# Altium project Thesis_HarvestEvaluator.PrjPcb
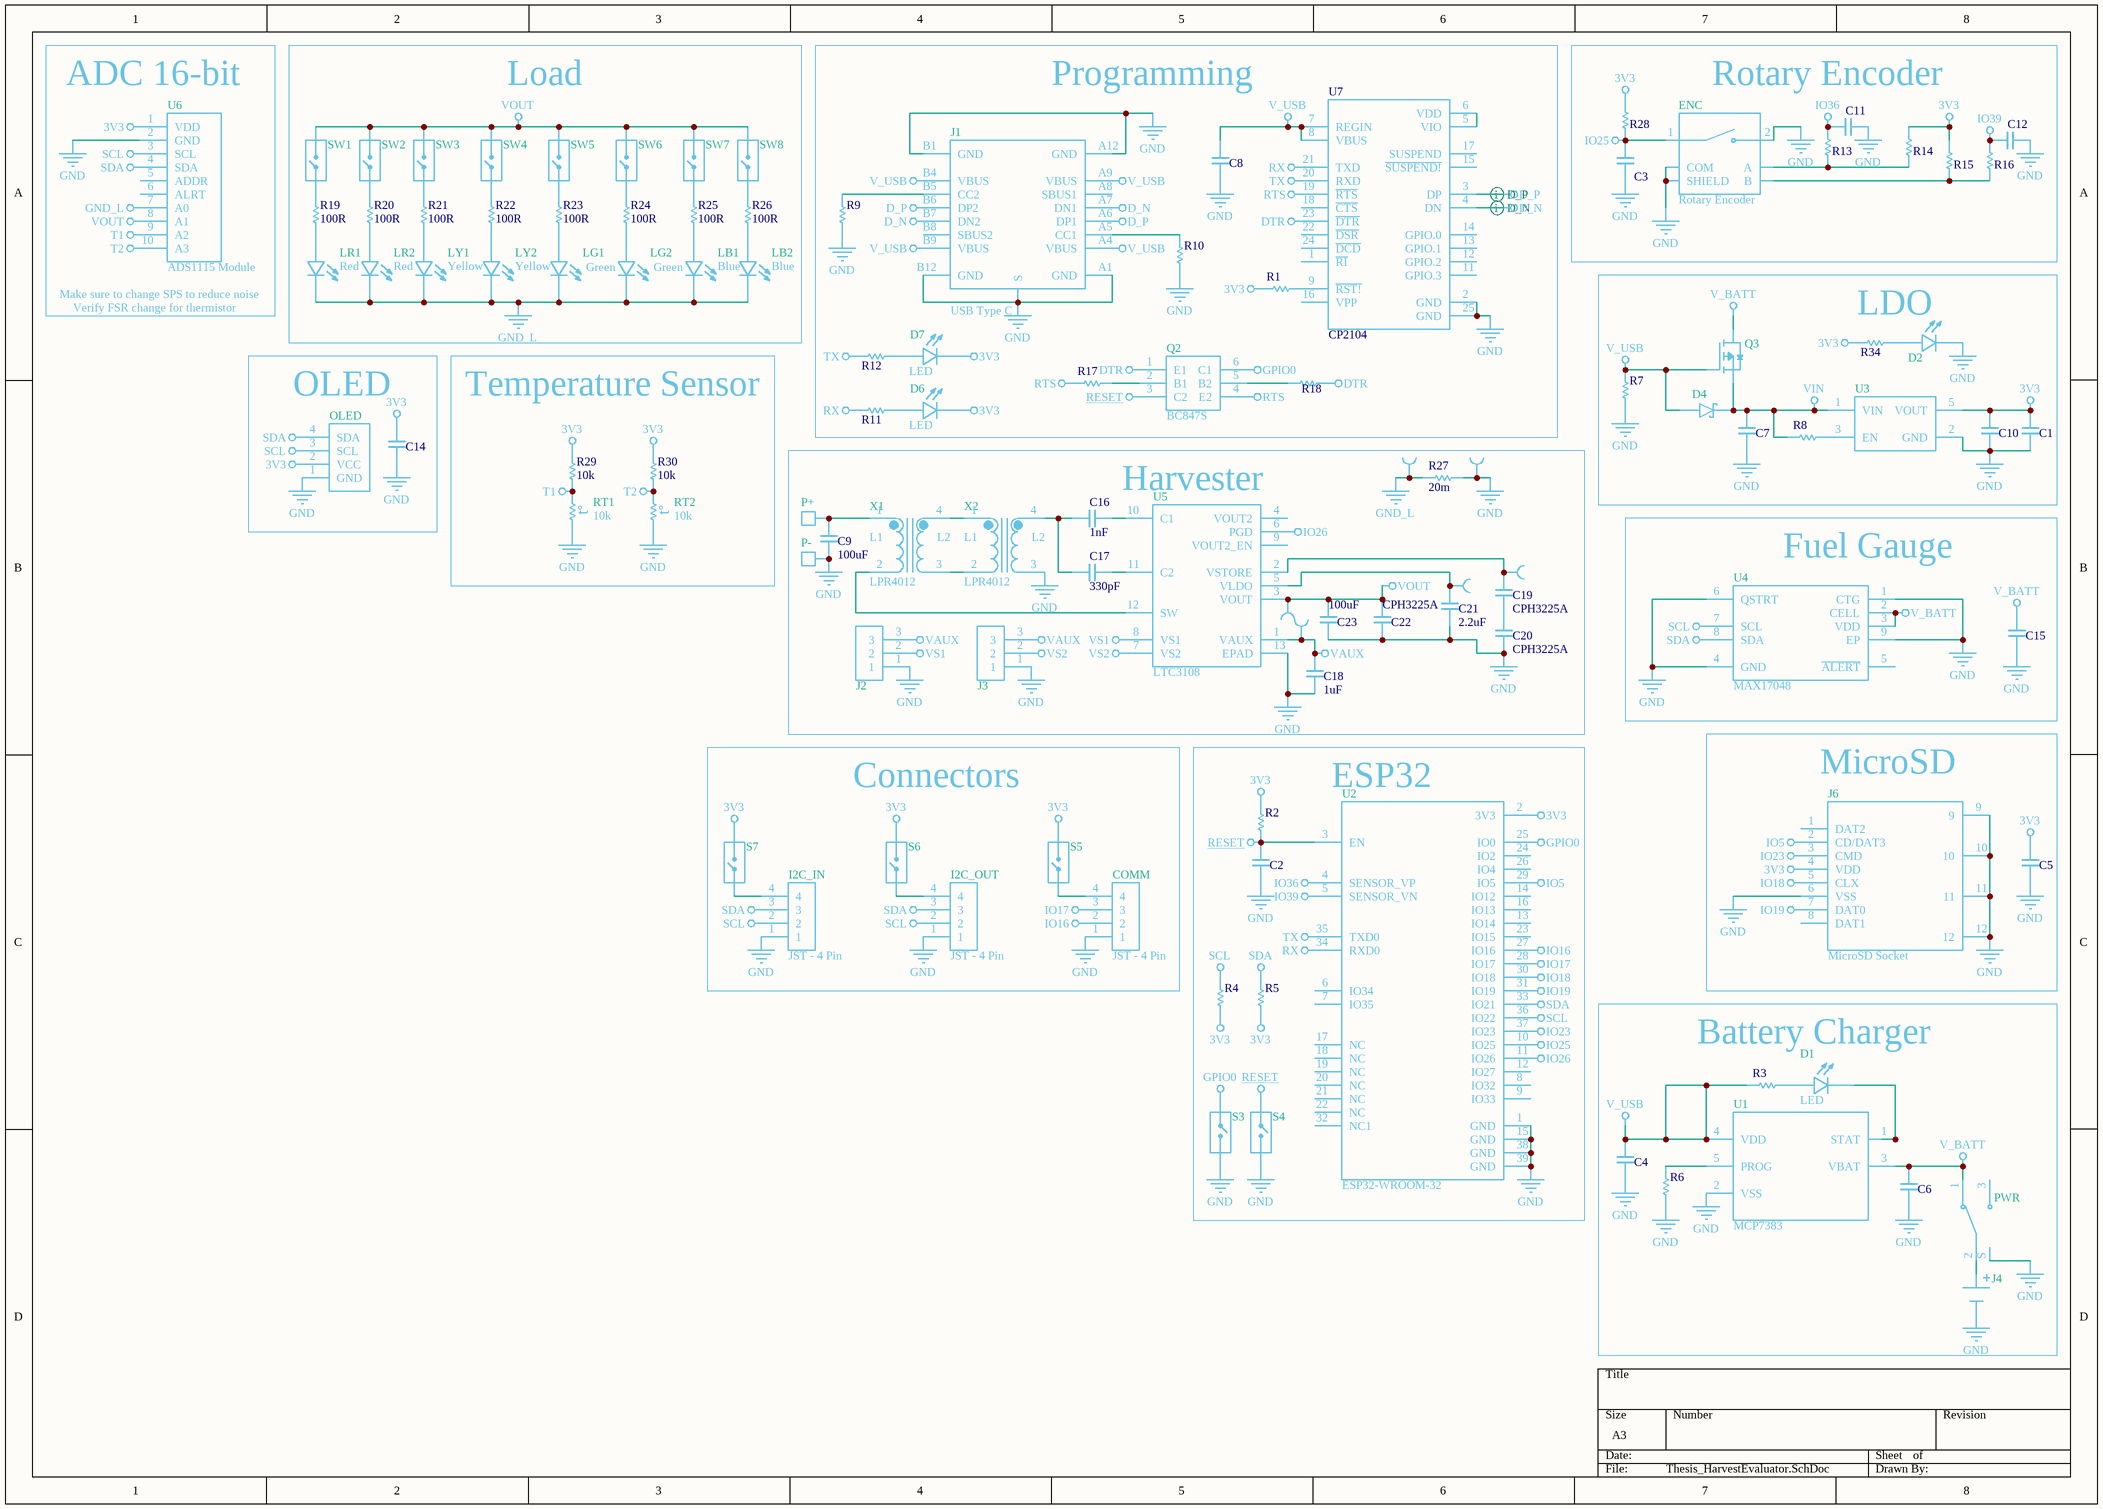
[diagram p0: Thesis_HarvestEvaluator.SchDoc]
1 sheet, 111 parts. Net scope: global (net labels, ports and power ports of the same name join across sheets).
Board file: Thesis_HarvestEvaluator.PcbDoc

## Sheet Thesis_HarvestEvaluator.SchDoc
size A3; SheetNumber: 1; SheetTotal: 1

### Parts
C1  Capacitor  [Capacitor 0402]  (value not drawn)
C2  Capacitor  [Capacitor 0402]  (value not drawn)
C3  Capacitor  [Capacitor 0402]  (value not drawn)
C4  Capacitor  [Capacitor 0603]  (value not drawn)
C5  Capacitor  [Capacitor 0402]  (value not drawn)
C6  Capacitor  [Capacitor 0402]  (value not drawn)
C7  Capacitor  [Capacitor 0402]  (value not drawn)
C8  Capacitor  [Capacitor 0402]  (value not drawn)
C9  100uF  [Capacitor 0805]
C10  Capacitor  [Capacitor 0402]  (value not drawn)
C11  Capacitor  [Capacitor 0402]  (value not drawn)
C12  Capacitor  [Capacitor 0402]  (value not drawn)
C14  Capacitor  [Capacitor 0402]  (value not drawn)
C15  Capacitor  [Capacitor 0402]  (value not drawn)
C16  1nF  [Capacitor 0402]
C17  330pF  [Capacitor 0402]
C18  1uF  [Capacitor 0402]
C19  CPH3225A  [CPH3225A]
C20  CPH3225A  [CPH3225A]
C21  2.2uF  [Capacitor 0402]
C22  CPH3225A  [CPH3225A]
C23  100uF  [Capacitor 0805]
COMM  JST - 4 Pin  [B4B-PH]
D1  LED  [LED 0603 - Yellow]
D2  LED  [LED 0603 - Red]  (value not drawn)
D4  Schottky Diode  [BAT60B]  (value not drawn)
D6  LED  [LED 0603 - Green]
D7  LED  [LED 0603 - Green]
ENC  Rotary Encoder  [PEC11R-4215F-S0024]
I2C_IN  JST - 4 Pin  [S4B-PH]
I2C_OUT  JST - 4 Pin  [S4B-PH]
J1  USB Type C  [USB Type C]
J2  Male Header - 3 Pin  [Male Header - 3 Pin]  (value not drawn)
J3  Male Header - 3 Pin  [Male Header - 3 Pin]  (value not drawn)
J4  BH-18650  [BH-18650 - No hole]  (value not drawn)
J6  MicroSD Socket  [MicroSD Socket]
LB1  Blue  [LED 0603 - Blue]
LB2  Blue  [LED 0603 - Blue]
LG1  Green  [LED 0603 - Green]
LG2  Green  [LED 0603 - Green]
LR1  Red  [LED 0603 - Red]
LR2  Red  [LED 0603 - Red]
LY1  Yellow  [LED 0603 - Yellow]
LY2  Yellow  [LED 0603 - Yellow]
OLED  OLED I2C  [OLED 1.3in module]  (value not drawn)
P+  Pad  [Pad]  (value not drawn)
P-  Pad  [Pad]  (value not drawn)
PWR  Switch - Horizontal  [MK-12C02-G015]  (value not drawn)
Q2  BC847S  [BC847S]
Q3  DMG230  [DMG230]  (value not drawn)
R1  Resistor  [Resistor 0402]  (value not drawn)
R2  Resistor  [Resistor 0402]  (value not drawn)
R3  Resistor  [Resistor 0402]  (value not drawn)
R4  Resistor  [Resistor 0402]  (value not drawn)
R5  Resistor  [Resistor 0402]  (value not drawn)
R6  Resistor  [Resistor 0603]  (value not drawn)
R7  Resistor  [Resistor 0402]  (value not drawn)
R8  Resistor  [Resistor 0402]  (value not drawn)
R9  Resistor  [Resistor 0402]  (value not drawn)
R10  Resistor  [Resistor 0402]  (value not drawn)
R11  Resistor  [Resistor 0402]  (value not drawn)
R12  Resistor  [Resistor 0402]  (value not drawn)
R13  Resistor  [Resistor 0402]  (value not drawn)
R14  Resistor  [Resistor 0402]  (value not drawn)
R15  Resistor  [Resistor 0402]  (value not drawn)
R16  Resistor  [Resistor 0402]  (value not drawn)
R17  Resistor  [Resistor 0402]  (value not drawn)
R18  Resistor  [Resistor 0402]  (value not drawn)
R19  100R  [Resistor 0402]
R20  100R  [Resistor 0402]
R21  100R  [Resistor 0402]
R22  100R  [Resistor 0402]
R23  100R  [Resistor 0402]
R24  100R  [Resistor 0402]
R25  100R  [Resistor 0402]
R26  100R  [Resistor 0402]
R27  20m  [Resistor 0402]
R28  Resistor  [Resistor 0402]  (value not drawn)
R29  10k  [Resistor 0402]
R30  10k  [Resistor 0402]
R34  Resistor  [Resistor 0402]  (value not drawn)
RT1  10k  [S2B-PH]
RT2  10k  [S2B-PH]
S3  Switch - 2 pin  [Push Button 3.5x6]  (value not drawn)
S4  Switch - 2 pin  [Push Button 3.5x6]  (value not drawn)
S5  Switch - 2 pin  [Male Header - 2 Pin]  (value not drawn)
S6  Switch - 2 pin  [Male Header - 2 Pin]  (value not drawn)
S7  Switch - 2 pin  [Male Header - 2 Pin]  (value not drawn)
SW1  Switch - 2 pin  [Male Header - 2 Pin]  (value not drawn)
SW2  Switch - 2 pin  [Male Header - 2 Pin]  (value not drawn)
SW3  Switch - 2 pin  [Male Header - 2 Pin]  (value not drawn)
SW4  Switch - 2 pin  [Male Header - 2 Pin]  (value not drawn)
SW5  Switch - 2 pin  [Male Header - 2 Pin]  (value not drawn)
SW6  Switch - 2 pin  [Male Header - 2 Pin]  (value not drawn)
SW7  Switch - 2 pin  [Male Header - 2 Pin]  (value not drawn)
SW8  Switch - 2 pin  [Male Header - 2 Pin]  (value not drawn)
TP1  Keystone 5001  [Keystone 5001]  (value not drawn)
TP2  Keystone 5001  [Keystone 5001]  (value not drawn)
TP3  Keystone 5001  [Keystone 5001]  (value not drawn)
TP4  Keystone 5001  [Keystone 5001]  (value not drawn)
TP5  Keystone 5001  [Keystone 5001]  (value not drawn)
TP6  Keystone 5001  [Keystone 5001]  (value not drawn)
U1  MCP7383  [MCP7383]
U2  ESP32-WROOM-32  [ESP32-WROOM-32D]
U3  XC6220  [XC6220]  (value not drawn)
U4  MAX17048  [MAX17048]
U5  LTC3108  [LTC3108]
U6  ADS1115 Module  [ADS1115 Module - No Hole]
U7  CP2104  [CP2104]
X1  LPR4012  [LPR4012]
X2  LPR4012  [LPR4012]

### Blocks framed on the sheet
ADC 16-bit: U6
Load: LB1 LB2 LG1 LG2 LR1 LR2 LY1 LY2 R19-R26 SW1-SW8
Programming: C8 D6 D7 J1 Q2 R1 R9-R12 R17 R18 U7
Rotary Encoder: C3 C11 C12 ENC R13-R16 R28
LDO: C1 C7 C10 D2 D4 Q3 R7 R8 R34 U3
OLED: C14 OLED
Temperature Sensor: R29 R30 RT1 RT2
Harvester: C9 C16-C23 J2 J3 P+ P- R27 TP1-TP6 U5 X1 X2
Fuel Gauge: C15 U4
Connectors: COMM I2C_IN I2C_OUT S5-S7
ESP32: C2 R2 R4 R5 S3 S4 U2
MicroSD: C5 J6
Battery Charger: C4 C6 D1 J4 PWR R3 R6 U1

### Nets
3V3: C1.1 C5.1 C10.1 C14.1 D6.C D7.C J6.4(VDD) OLED.2(VCC) R1.1 R2.2 R4.1 R5.1 R14.2 R15.2 R28.2 R29.2 R30.2 R34.2 S5.2 S6.2 S7.2 U2.2(3V3) U3.5(VOUT) U6.1(VDD)
D_N: J1.A7(DN1) J1.B7(DN2) U7.4(DN)
D_P: J1.A6(DP1) J1.B6(DP2) U7.3(DP)
DTR: Q2.1(E1) R18.2 U7.23(~{DTR})
GND: C1.2 C2.2 C3.2 C4.2 C5.2 C6.2 C7.2 C8.2 C9.2 C10.2 C11.1 C12.1 C14.2 C15.2 C18.2 C20.2 C21.2 C22.2 C23.2 COMM.1 D2.C ENC.2 ENC.COM ENC.S(SHIELD) I2C_IN.1 I2C_OUT.1 J1.A1(GND) J1.A12(GND) J1.B1(GND) J1.B12(GND) J1.S J2.1 J3.1 J4.N(NEG) J6.6(VSS) J6.9 J6.10 J6.11 J6.12 OLED.1(GND) P-.1 PWR.S R6.1 R7.1 R9.1 R10.1 R27.1 RT1.1 RT2.1 S3.2 S4.2 TP6.1 U1.2(VSS) U2.1(GND) U2.15(GND) U2.38(GND) U2.39(GND) U3.2(GND) U4.1(CTG) U4.4(GND) U4.6(QSTRT) U4.9(EP) U5.13(EPAD) U6.2(GND) U7.2(GND) U7.25(GND) X2.3
GND_L: LB1.C LB2.C LG1.C LG2.C LR1.C LR2.C LY1.C LY2.C R27.2 TP5.1 U6.7(A0)
GPIO0: Q2.6(C1) S3.1 U2.25(IO0)
IO5: J6.2(CD/DAT3) U2.29(IO5)
IO16: COMM.2 U2.27(IO16)
IO17: COMM.3 U2.28(IO17)
IO18: J6.5(CLX) U2.30(IO18)
IO19: J6.7(DAT0) U2.31(IO19)
IO23: J6.3(CMD) U2.37(IO23)
IO25: C3.1 ENC.1 R28.1 U2.10(IO25)
IO26: U2.11(IO26) U5.6(PGD)
IO36: C11.2 R13.2 U2.4(SENSOR_VP)
IO39: C12.2 R16.1 U2.5(SENSOR_VN)
RESET: C2.1 Q2.3(C2) R2.1 S4.1 U2.3(EN)
RTS: Q2.4(E2) R17.1 U7.19(~{RTS})
RX: R11.2 U2.34(RXD0) U7.21(TXD)
SCL: I2C_IN.2 I2C_OUT.2 OLED.3(SCL) R4.2 U2.36(IO22) U4.7(SCL) U6.3(SCL)
SDA: I2C_IN.3 I2C_OUT.3 OLED.4(SDA) R5.2 U2.33(IO21) U4.8(SDA) U6.4(SDA)
T1: R29.1 RT1.2 U6.9(A2)
T2: R30.1 RT2.2 U6.10(A3)
TX: R12.2 U2.35(TXD0) U7.20(RXD)
V_BATT: C6.1 C15.1 PWR.1 Q3.3(D) U1.3(VBAT) U4.2(CELL) U4.3(VDD)
V_USB: C4.1 C8.1 D4.A J1.A4(VBUS) J1.A9(VBUS) J1.B4(VBUS) J1.B9(VBUS) Q3.1(G) R3.1 R7.2 U1.4(VDD) U7.7(REGIN) U7.8(VBUS)
VAUX: C18.1 J2.3 J3.3 TP1.1 U5.1(VAUX)
VIN: C7.1 D4.C Q3.2(S) R8.1 U3.1(VIN)
VOUT: C22.1 C23.1 SW1.2 SW2.2 SW3.2 SW4.2 SW5.2 SW6.2 SW7.2 SW8.2 TP3.1 U5.3(VOUT) U6.8(A1)
VS1: J2.2 U5.8(VS1)
VS2: J3.2 U5.7(VS2)
NetC9_1: C9.1 P+.1 X1.1
NetC16_1: C16.1 U5.10(C1)
NetC16_2: C16.2 C17.2 X2.4
NetC17_1: C17.1 U5.11(C2)
NetC19_1: C19.1 TP2.1 U5.2(VSTORE)
NetC19_2: C19.2 C20.1
NetC21_1: C21.1 TP4.1 U5.5(VLDO)
NetCOMM_4: COMM.4 S5.1
NetD1_A: D1.A R3.2
NetD1_C: D1.C U1.1(STAT)
NetD2_A: D2.A R34.1
NetD6_A: D6.A R11.1
NetD7_A: D7.A R12.1
NetENC_A: ENC.A R13.1 R14.1
NetENC_B: ENC.B R15.1 R16.2
NetI2C_IN_4: I2C_IN.4 S7.1
NetI2C_OUT_4: I2C_OUT.4 S6.1
NetJ1_A5: J1.A5(CC1) R10.2
NetJ1_B5: J1.B5(CC2) R9.2
NetJ4_P: J4.P(POS) PWR.2
NetLB1_A: LB1.A R25.1
NetLB2_A: LB2.A R26.1
NetLG1_A: LG1.A R23.1
NetLG2_A: LG2.A R24.1
NetLR1_A: LR1.A R19.1
NetLR2_A: LR2.A R20.1
NetLY1_A: LY1.A R21.1
NetLY2_A: LY2.A R22.1
NetQ2_2: Q2.2(B1) R17.2
NetQ2_5: Q2.5(B2) R18.1
NetR1_2: R1.2 U7.9(~{RST!})
NetR6_2: R6.2 U1.5(PROG)
NetR8_2: R8.2 U3.3(EN)
NetR19_2: R19.2 SW1.1
NetR20_2: R20.2 SW2.1
NetR21_2: R21.2 SW3.1
NetR22_2: R22.2 SW4.1
NetR23_2: R23.2 SW5.1
NetR24_2: R24.2 SW6.1
NetR25_2: R25.2 SW7.1
NetR26_2: R26.2 SW8.1
NetU5_12: U5.12(SW) X1.2
NetU7_5: U7.5(VIO) U7.6(VDD)
NetX1_3: X1.3 X2.2
NetX1_4: X1.4 X2.1

Not connected (* = marked no-connect by the designer): J1 A8(SBUS1) B8(SBUS2); J6 1(DAT2) 8(DAT1); PWR 3; U2 6(IO34) 7(IO35) 8(IO32) 9(IO33) 12(IO27) 13(IO14) 14(IO12) 16(IO13) 17(NC) 18(NC) 19(NC) 20(NC) 21(NC) 22(NC) 23(IO15) 24(IO2) 26(IO4) 32(NC1); U4 5(~{ALERT}); U5 4(VOUT2) 9(VOUT2_EN); U6 5(ADDR) 6(ALRT); U7 1(~{RI}) 11(GPIO.3) 12(GPIO.2) 13(GPIO.1) 14(GPIO.0) 15(~{SUSPEND!}) 16(VPP) 17(SUSPEND) 18(~{CTS}) 22(~{DSR}) 24(~{DCD})

### Layout directives
differential pair: D_N, D_P

### Notes on the sheet
- (near LR1) Make sure to change SPS to reduce noise
- Verify FSR change for thermistor
- (in symbol LPR4012) L1; L2
- (in symbol Thermistor) t°

### Library data of the parts
C1 C2 = Capacitor: Value: 10uF
C3 C5 C14 C15 = Capacitor: Value: 100nF
C4 C6 = Capacitor: Value: 4.7uF
C7 C8 C10 = Capacitor: Value: 1uF
C9 C16-C23 = Capacitor
  C9 C23: Value: 100uF
  C16: Value: 1nF
  C17: Value: 330pF
  C18: Value: 1uF
  C19 C20 C22: Value: *
  C21: Value: 2.2uF
C11 C12 = Capacitor: Value: 10nF
D1 = LED: Value: Yellow
D2 = LED: Value: Red
D6 D7 = LED: Value: Green
LB1 LB2 LG1 LG2 LR1 LR2 LY1 LY2 = LED
  LB1 LB2: Value: Blue
  LG1 LG2: Value: Green
  LR1 LR2: Value: Red
  LY1 LY2: Value: Yellow
R1 R3 R11 R12 R34 = Resistor: Value: 1k
R2 R4 R5 R7 R13-R18 R28 = Resistor: Value: 10k
R6 = Resistor: Value: 2k
R8 = Resistor: Value: 10K
R9 R10 = Resistor: Value: 5.1k
R19-R26 R29 R30 = Resistor: May be 0R or 1k
  R19-R26: Value: 100R
  R29 R30: Value: 10k
R27 = Resistor: Consider different shunt ranges; Value: 20m
RT1 RT2 = Thermistor